# EAGLE schematic prototype1-with-charging-circut (EAGLE 9.2.2)

## Sheet 1 of 4
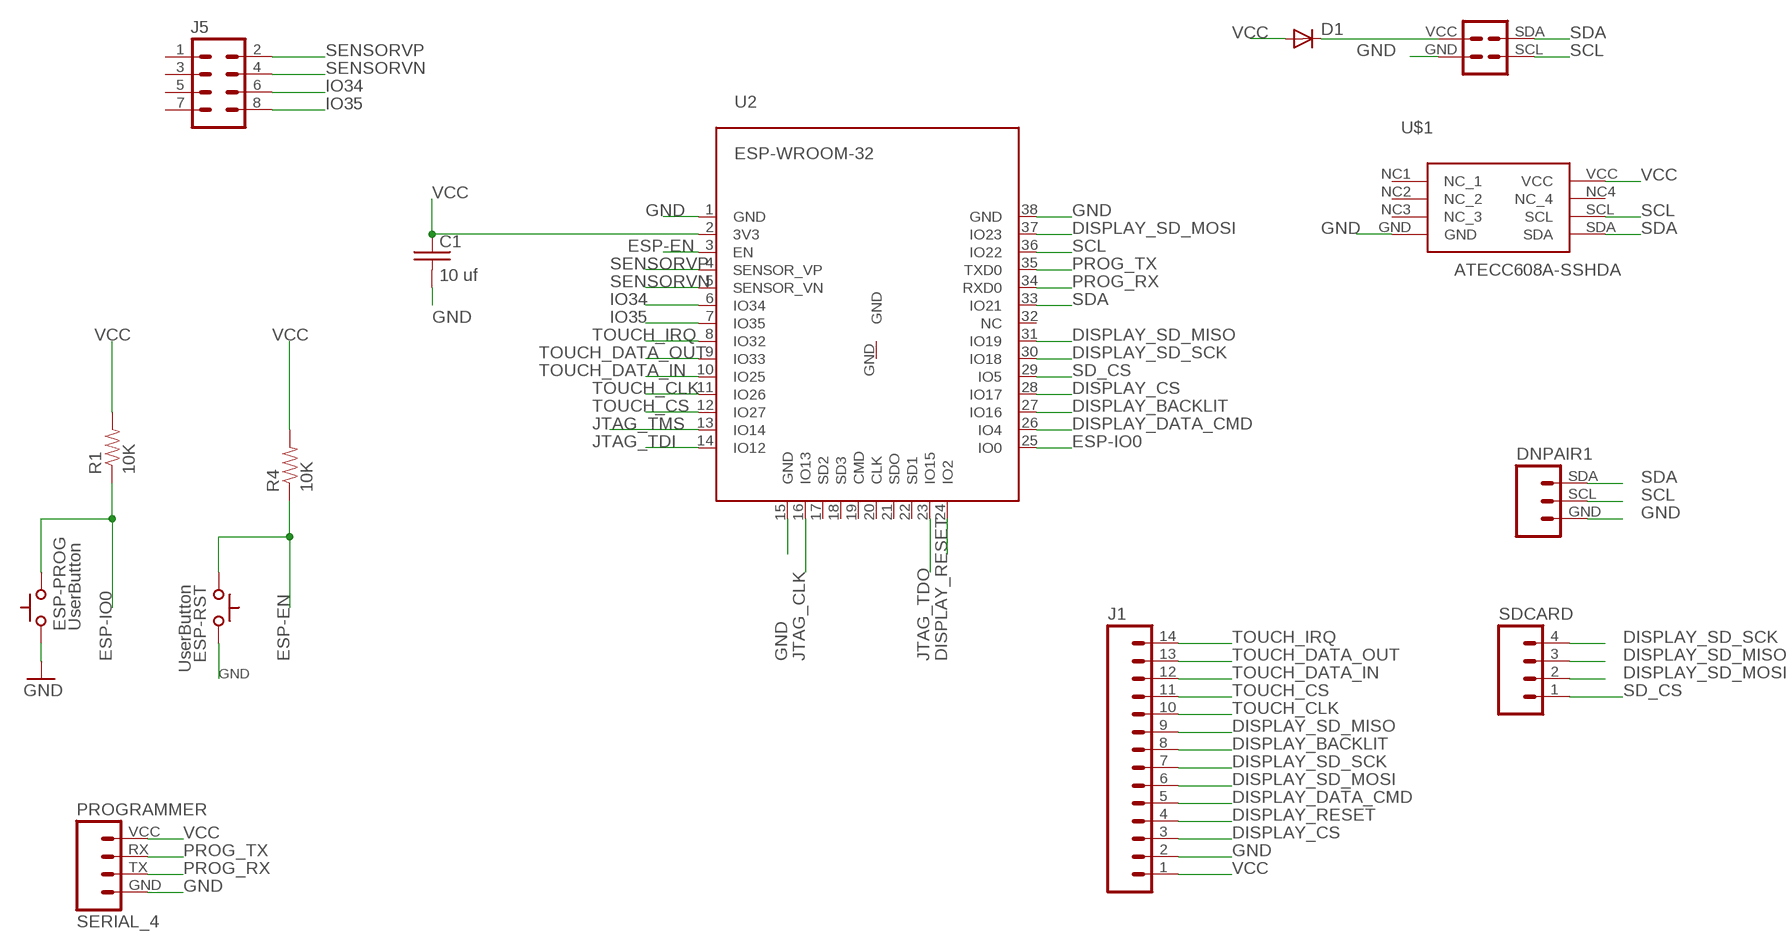
[diagram p0: schematic, sheet 1]

### Parts
C1  10 uf  C-USC0805  [C0805]
D1  DIODESMA  [SMA-DIODE]
DNPAIR1  DARKNET_8_PAIR_CONNECTORPTH  [1X03]
ESP-PROG  UserButton  SWITCH_TACTILETACTILE-2PIN-NARROW  [TACTILE-2PIN-NARROW]
ESP-RST  UserButton  SWITCH_TACTILETACTILE-2PIN-NARROW  [TACTILE-2PIN-NARROW]
J1  M14  [1X14]
J5  M04X2  [2X4]
PROGRAMMER  SERIAL_4  [SERIAL_HEADER_4]
R1  10K  RESISTOR0805-RES  [0805]
R4  10K  RESISTOR0805-RES  [0805]
SDCARD  M04PTH  [1X04]
SHITTY_ADDON  SAO1  DC26_SHITTY_ADDON_CONNECTORPTH  [DC26SHITTY_ADDON_CONNECTOR]
U2  ESP-WROOM-32  [ESP-WROOM-32]
U$1  ATECC608A-SSHDA  [8-SOIC]

### Nets
DISPLAY_BACKLIT: J1.8 U2.27(IO16)
DISPLAY_CS: J1.3 U2.28(IO17)
DISPLAY_DATA_CMD: J1.5 U2.26(IO4)
DISPLAY_RESET: J1.4 U2.24(IO2)
DISPLAY_SD_MISO: J1.9 SDCARD.3 U2.31(IO19)
DISPLAY_SD_MOSI: J1.6 SDCARD.2 U2.37(IO23)
DISPLAY_SD_SCK: J1.7 SDCARD.4 U2.30(IO18)
ESP-EN: ESP-RST.P$2(C) R4.1 U2.3(EN)
ESP-IO0: ESP-PROG.P$1(A) R1.1 U2.25(IO0)
GND: C1.2 DNPAIR1.GND ESP-PROG.P$2(C) ESP-RST.P$1(A) J1.2 PROGRAMMER.GND SHITTY_ADDON.GND U2.1(GND) U2.15(GND) U2.38(GND) U$1.GND ; also sheet 2,3,4
IO34: J5.6 U2.6(IO34)
IO35: J5.8 U2.7(IO35)
JTAG_CLK: U2.16(IO13) ; also sheet 2
JTAG_TDI: U2.14(IO12) ; also sheet 2
JTAG_TDO: U2.23(IO15) ; also sheet 2
JTAG_TMS: U2.13(IO14) ; also sheet 2
N$14: D1.C SHITTY_ADDON.VCC
PROG_RX: PROGRAMMER.TX U2.34(RXD0) ; also sheet 2
PROG_TX: PROGRAMMER.RX U2.35(TXD0) ; also sheet 2
SCL: DNPAIR1.SCL SHITTY_ADDON.SCL U2.36(IO22) U$1.SCL
SD_CS: SDCARD.1 U2.29(IO5)
SDA: DNPAIR1.SDA SHITTY_ADDON.SDA U2.33(IO21) U$1.SDA
SENSORVN: J5.4 U2.5(SENSOR_VN)
SENSORVP: J5.2 U2.4(SENSOR_VP)
TOUCH_CLK: J1.10 U2.11(IO26)
TOUCH_CS: J1.11 U2.12(IO27)
TOUCH_DATA_IN: J1.12 U2.10(IO25)
TOUCH_DATA_OUT: J1.13 U2.9(IO33)
TOUCH_IRQ: J1.14 U2.8(IO32)
VCC: C1.1 D1.A J1.1 PROGRAMMER.VCC R1.2 R4.2 U2.2(3V3) U$1.VCC ; also sheet 2,3,4
Unconnected: J5.1 J5.3 J5.5 J5.7 U2.17(SD2) U2.18(SD3) U2.19(CMD) U2.20(CLK) U2.21(SDO) U2.22(SD1) U2.32(NC) U2.GND U$1.NC1(NC_1) U$1.NC2(NC_2) U$1.NC3(NC_3) U$1.NC4(NC_4)

## Sheet 2 of 4
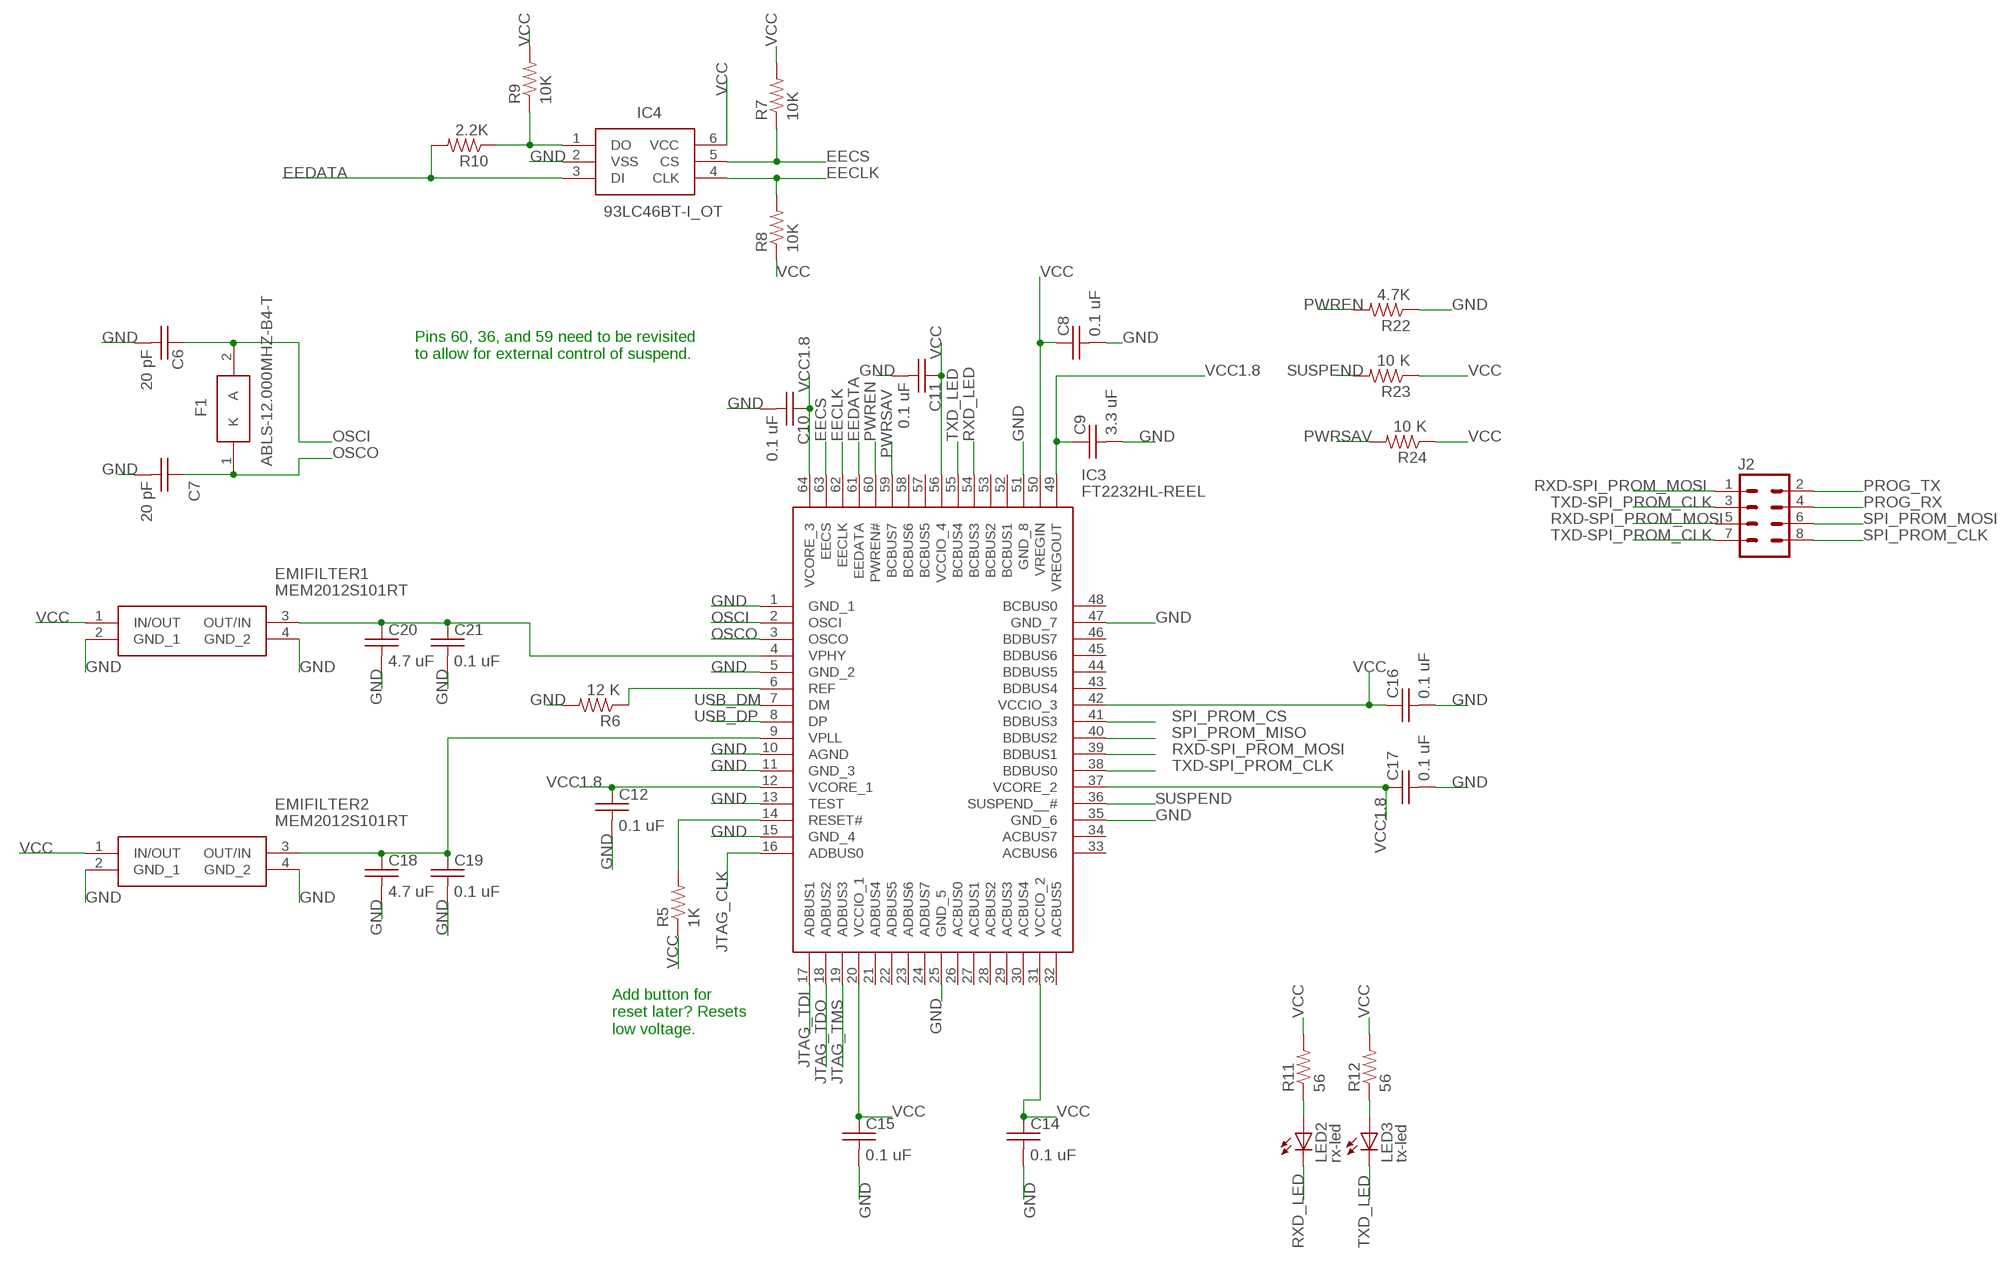
[diagram p1: schematic, sheet 2]

### Parts
C6  20 pF  C-USC0805  [C0805]
C7  20 pF  C-USC0805  [C0805]
C8  0.1 uF  C-USC0805  [C0805]
C9  3.3 uF  C-USC0805  [C0805]
C10  0.1 uF  C-USC0805  [C0805]
C11  0.1 uF  C-USC0805  [C0805]
C12  0.1 uF  C-USC0805  [C0805]
C14  0.1 uF  C-USC0805  [C0805]
C15  0.1 uF  C-USC0805  [C0805]
C16  0.1 uF  C-USC0805  [C0805]
C17  0.1 uF  C-USC0805  [C0805]
C18  4.7 uF  C-USC0805  [C0805]
C19  0.1 uF  C-USC0805  [C0805]
C20  4.7 uF  C-USC0805  [C0805]
C21  0.1 uF  C-USC0805  [C0805]
EMIFILTER1  MEM2012S101RT  [MEM2012S101RT]
EMIFILTER2  MEM2012S101RT  [MEM2012S101RT]
F1  ABLS-12.000MHZ-B4-T  [HC/49US-(AT49)_1]
IC3  FT2232HL-REEL  [QFP50P1200X1200X160-64N]
IC4  93LC46BT-I_OT  [SOT95P270X145-6N]
J2  M04X2  [2X4]
LED2  rx-led  LED3MM  [LED3MM]
LED3  tx-led  LED3MM  [LED3MM]
R5  1K  RESISTOR0805-RES  [0805]
R6  12 K  RESISTOR0805-RES  [0805]
R7  10K  RESISTOR0805-RES  [0805]
R8  10K  RESISTOR0805-RES  [0805]
R9  10K  RESISTOR0805-RES  [0805]
R10  2.2K  RESISTOR0805-RES  [0805]
R11  56  RESISTOR0805-RES  [0805]
R12  56  RESISTOR0805-RES  [0805]
R22  4.7K  RESISTOR0805-RES  [0805]
R23  10 K  RESISTOR0805-RES  [0805]
R24  10 K  RESISTOR0805-RES  [0805]

### Nets
EECLK: IC3.62(EECLK) IC4.4(CLK) R8.2
EECS: IC3.63(EECS) IC4.5(CS) R7.1
EEDATA: IC3.61(EEDATA) IC4.3(DI) R10.2
GND: C6.2 C7.2 C8.2 C9.2 C10.2 C11.2 C12.2 C14.2 C15.2 C16.2 C17.2 C18.2 C19.2 C20.2 C21.2 EMIFILTER1.2(GND_1) EMIFILTER1.4(GND_2) EMIFILTER2.2(GND_1) EMIFILTER2.4(GND_2) IC3.1(GND_1) IC3.5(GND_2) IC3.10(AGND) IC3.11(GND_3) IC3.13(TEST) IC3.15(GND_4) IC3.25(GND_5) IC3.35(GND_6) IC3.47(GND_7) IC3.51(GND_8) IC4.2(VSS) R6.2 R22.1 ; also sheet 1,3,4
JTAG_CLK: IC3.16(ADBUS0) ; also sheet 1
JTAG_TDI: IC3.17(ADBUS1) ; also sheet 1
JTAG_TDO: IC3.18(ADBUS2) ; also sheet 1
JTAG_TMS: IC3.19(ADBUS3) ; also sheet 1
N$6: IC3.14(RESET#) R5.2
N$7: IC3.6(REF) R6.1
N$8: IC4.1(DO) R9.1 R10.1
N$11: LED2.A R11.1
N$13: LED3.A R12.1
N$18: C18.1 C19.1 EMIFILTER2.3(OUT/IN) IC3.9(VPLL)
N$19: C20.1 C21.1 EMIFILTER1.3(OUT/IN) IC3.4(VPHY)
OSCI: C6.1 F1.2(A) IC3.2(OSCI)
OSCO: C7.1 F1.1(K) IC3.3(OSCO)
PROG_RX: J2.4 ; also sheet 1
PROG_TX: J2.2 ; also sheet 1
PWREN: IC3.60(PWREN#) R22.2
PWRSAV: IC3.59(BCBUS7) R24.2
RXD-SPI_PROM_MOSI: IC3.39(BDBUS1) J2.1 J2.5
RXD_LED: IC3.54(BCBUS3) LED2.K(C)
SPI_PROM_CLK: J2.8 ; also sheet 3
SPI_PROM_CS: IC3.41(BDBUS3) ; also sheet 3
SPI_PROM_MISO: IC3.40(BDBUS2) ; also sheet 3
SPI_PROM_MOSI: J2.6 ; also sheet 3
SUSPEND: IC3.36(SUSPEND__#) R23.2
TXD-SPI_PROM_CLK: IC3.38(BDBUS0) J2.3 J2.7
TXD_LED: IC3.55(BCBUS4) LED3.K(C)
USB_DM: IC3.7(DM) ; also sheet 4
USB_DP: IC3.8(DP) ; also sheet 4
VCC: C8.1 C11.1 C14.1 C15.1 C16.1 EMIFILTER1.1(IN/OUT) EMIFILTER2.1(IN/OUT) IC3.20(VCCIO_1) IC3.31(VCCIO_2) IC3.42(VCCIO_3) IC3.50(VREGIN) IC3.56(VCCIO_4) IC4.6(VCC) R5.1 R7.2 R8.1 R9.2 R11.2 R12.2 R23.1 R24.1 ; also sheet 1,3,4
VCC1.8: C9.1 C10.1 C12.1 C17.1 IC3.12(VCORE_1) IC3.37(VCORE_2) IC3.49(VREGOUT) IC3.64(VCORE_3)
Unconnected: IC3.21(ADBUS4) IC3.22(ADBUS5) IC3.23(ADBUS6) IC3.24(ADBUS7) IC3.26(ACBUS0) IC3.27(ACBUS1) IC3.28(ACBUS2) IC3.29(ACBUS3) IC3.30(ACBUS4) IC3.32(ACBUS5) IC3.33(ACBUS6) IC3.34(ACBUS7) IC3.43(BDBUS4) IC3.44(BDBUS5) IC3.45(BDBUS6) IC3.46(BDBUS7) IC3.48(BCBUS0) IC3.52(BCBUS1) IC3.53(BCBUS2) IC3.57(BCBUS5) IC3.58(BCBUS6)

### Notes on the sheet
- Pins 60, 36, and 59 need to be revisited 
  to allow for external control of suspend.
- Add button for 
  reset later? Resets
  low voltage.

## Sheet 3 of 4
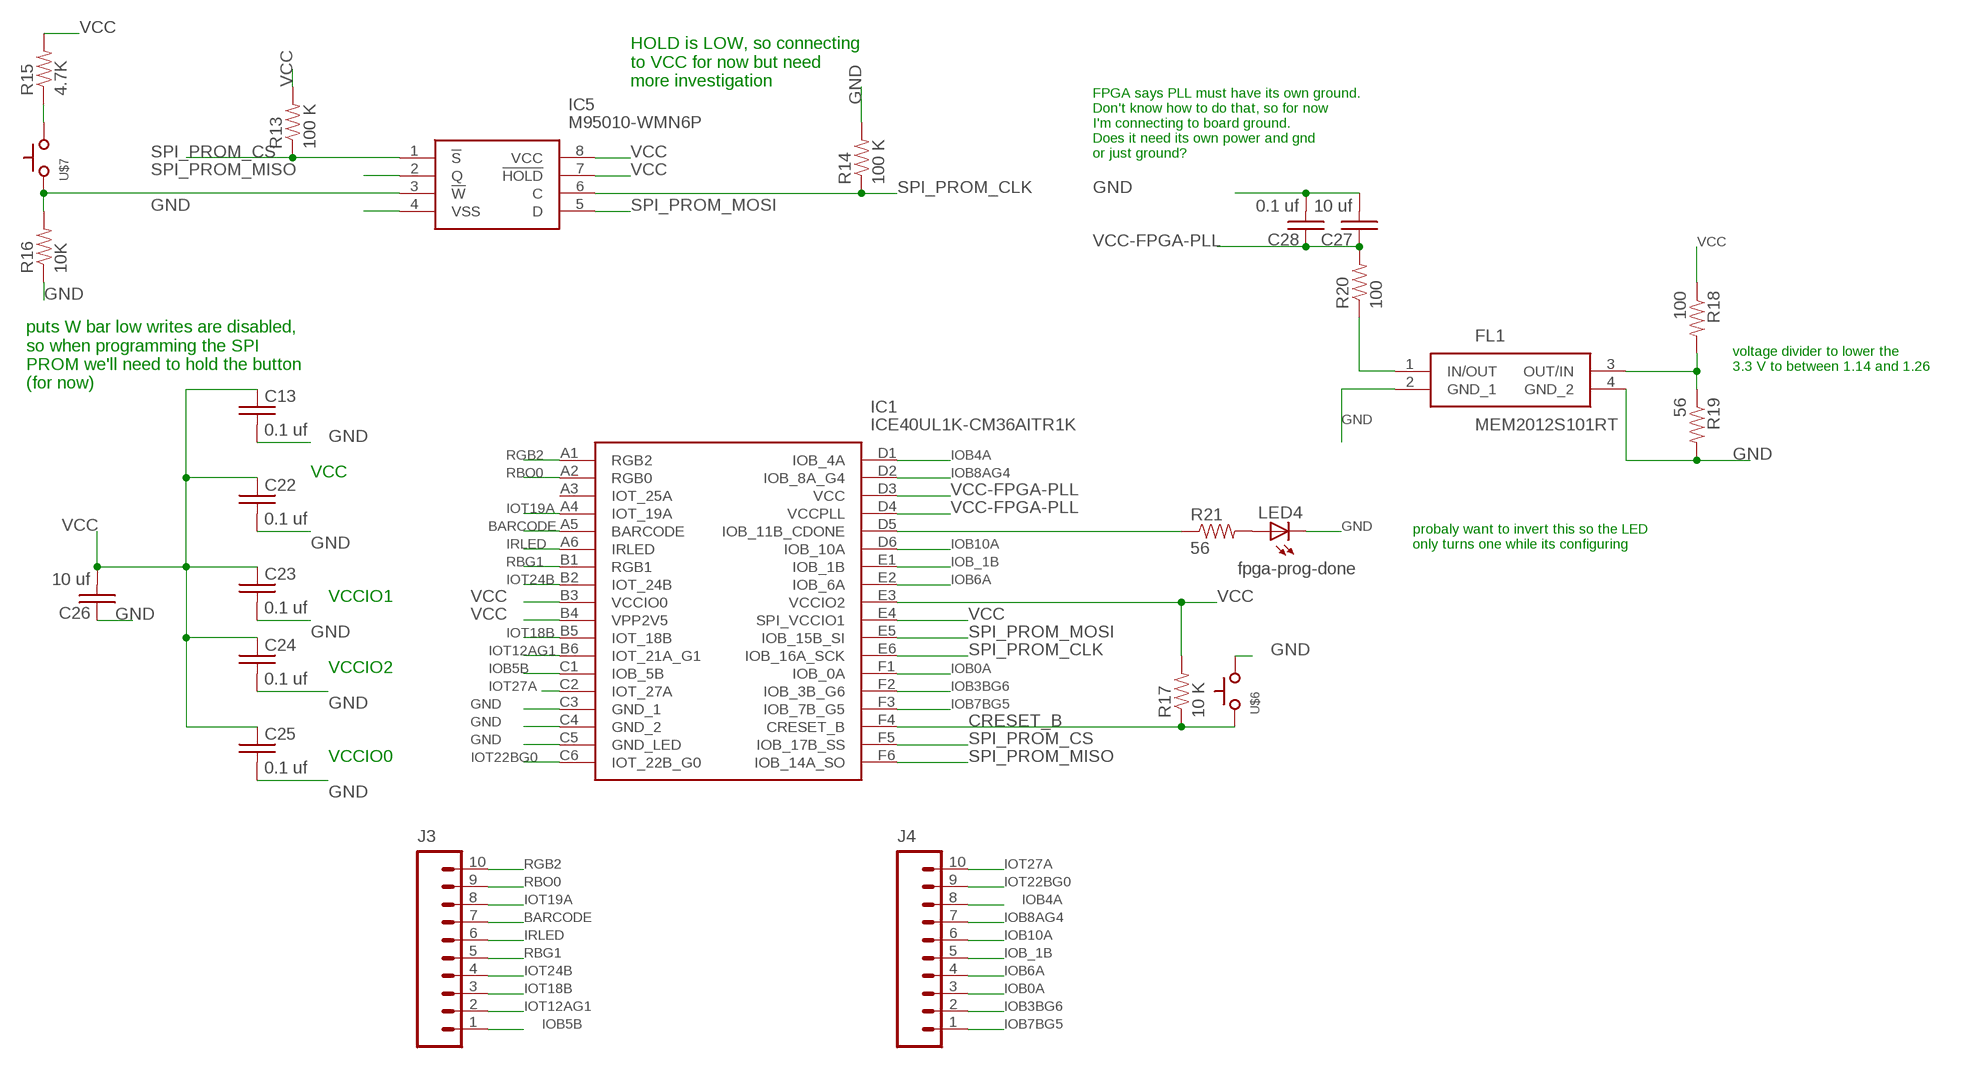
[diagram p2: schematic, sheet 3]

### Parts
C13  0.1 uf  C-USC0805  [C0805]
C22  0.1 uf  C-USC0805  [C0805]
C23  0.1 uf  C-USC0805  [C0805]
C24  0.1 uf  C-USC0805  [C0805]
C25  0.1 uf  C-USC0805  [C0805]
C26  10 uf  C-USC0805  [C0805]
C27  10 uf  C-USC0805  [C0805]
C28  0.1 uf  C-USC0805  [C0805]
FL1  MEM2012S101RT  [MEM2012S101RT]
IC1  ICE40UL1K-CM36AITR1K  [BGA36C40P6X6_250X250X91]
IC5  M95010-WMN6P  [SOIC127P600X175-8N]
J3  M10SILK_FEMALE_PTH  [1X10]
J4  M10SILK_FEMALE_PTH  [1X10]
LED4  fpga-prog-done  LED3MM  [LED3MM]
R13  100 K  RESISTOR0805-RES  [0805]
R14  100 K  RESISTOR0805-RES  [0805]
R15  4.7K  RESISTOR0805-RES  [0805]
R16  10K  RESISTOR0805-RES  [0805]
R17  10 K  RESISTOR0805-RES  [0805]
R18  100  RESISTOR0805-RES  [0805]
R19  56  RESISTOR0805-RES  [0805]
R20  100  RESISTOR0805-RES  [0805]
R21  56  RESISTOR0805-RES  [0805]
U$6  SWITCH_TACTILETACTILE-2PIN  [TACTILE-2PIN]
U$7  SWITCH_TACTILETACTILE-2PIN  [TACTILE-2PIN]

### Nets
BARCODE: IC1.A5(BARCODE) J3.7
CRESET_B: IC1.F4(CRESET_B) R17.1 U$6.P$2(C)
GND: C13.2 C22.2 C23.2 C24.2 C25.2 C26.1 C27.2 C28.2 FL1.2(GND_1) FL1.4(GND_2) IC1.C3(GND_1) IC1.C4(GND_2) IC1.C5(GND_LED) IC5.4(VSS) LED4.K(C) R14.2 R16.1 R19.2 U$6.P$1(A) ; also sheet 1,2,4
IOB0A: IC1.F1(IOB_0A) J4.3
IOB3BG6: IC1.F2(IOB_3B_G6) J4.2
IOB4A: IC1.D1(IOB_4A) J4.8
IOB5B: IC1.C1(IOB_5B) J3.1
IOB6A: IC1.E2(IOB_6A) J4.4
IOB7BG5: IC1.F3(IOB_7B_G5) J4.1
IOB8AG4: IC1.D2(IOB_8A_G4) J4.7
IOB10A: IC1.D6(IOB_10A) J4.6
IOB_1B: IC1.E1(IOB_1B) J4.5
IOT12AG1: IC1.B6(IOT_21A_G1) J3.2
IOT18B: IC1.B5(IOT_18B) J3.3
IOT19A: IC1.A4(IOT_19A) J3.8
IOT22BG0: IC1.C6(IOT_22B_G0) J4.9
IOT24B: IC1.B2(IOT_24B) J3.4
IOT27A: IC1.C2(IOT_27A) J4.10
IRLED: IC1.A6(IRLED) J3.6
N$3: IC5.3(!W) R16.2 U$7.P$2(C)
N$9: R15.1 U$7.P$1(A)
N$10: LED4.A R21.2
N$15: FL1.3(OUT/IN) R18.2 R19.1
N$16: FL1.1(IN/OUT) R20.1
N$17: IC1.D5(IOB_11B_CDONE) R21.1
RBG1: IC1.B1(RGB1) J3.5
RBO0: IC1.A2(RGB0) J3.9
RGB2: IC1.A1(RGB2) J3.10
SPI_PROM_CLK: IC1.E6(IOB_16A_SCK) IC5.6(C) R14.1 ; also sheet 2
SPI_PROM_CS: IC1.F5(IOB_17B_SS) IC5.1(!S) R13.1 ; also sheet 2
SPI_PROM_MISO: IC1.F6(IOB_14A_SO) IC5.2(Q) ; also sheet 2
SPI_PROM_MOSI: IC1.E5(IOB_15B_SI) IC5.5(D) ; also sheet 2
VCC: C13.1 C22.1 C23.1 C24.1 C25.1 C26.2 IC1.B3(VCCIO0) IC1.B4(VPP2V5) IC1.E3(VCCIO2) IC1.E4(SPI_VCCIO1) IC5.7(!HOLD) IC5.8(VCC) R13.2 R15.2 R17.2 R18.1 ; also sheet 1,2,4
VCC-FPGA-PLL: C27.1 C28.1 IC1.D3(VCC) IC1.D4(VCCPLL) R20.2
Unconnected: IC1.A3(IOT_25A)

### Notes on the sheet
- HOLD is LOW, so connecting 
  to VCC for now but need 
  more investigation
- FPGA says PLL must have its own ground.
  Don't know how to do that, so for now 
  I'm connecting to board ground.  
  Does it need its own power and gnd 
  or just ground?
- voltage divider to lower the 
  3.3 V to between 1.14 and 1.26
- puts W bar low writes are disabled, 
  so when programming the SPI 
  PROM we'll need to hold the button 
  (for now)
- VCC
- probaly want to invert this so the LED 
  only turns one while its configuring
- VCCIO1
- VCCIO2
- VCCIO0

## Sheet 4 of 4
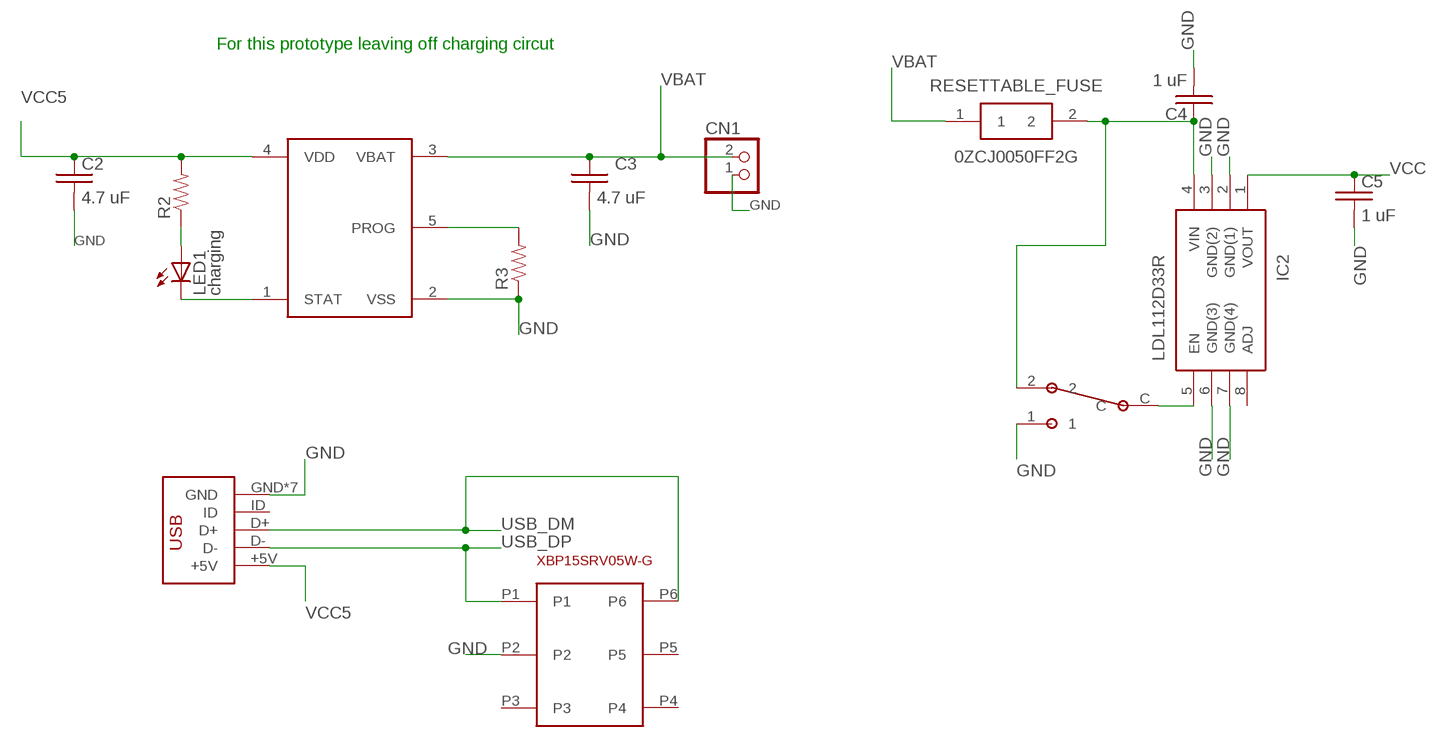
[diagram p3: schematic, sheet 4]

### Parts
C2  4.7 uF  C-USC0805  [C0805]
C3  4.7 uF  C-USC0805  [C0805]
C4  1 uF  C-USC0805  [C0805]
C5  1 uF  C-USC0805  [C0805]
CN1  JST_2PIN-THM-RA  [JST-PH-2-THM-RA]
IC2  LDL112D33R  [SOIC127P600X175-8N]
LED1  charging  LED0603  [LED-0603]
R2  RESISTOR0805-RES  [0805]
R3  RESISTOR0805-RES  [0805]
RESETTABLE_FUSE  0ZCJ0050FF2G  [FUSC3216X55N]
U$2  DX4R005JJ2DX4R005JJ2  [DX4R005JJ2]
U$3  XBP15SRV05W-G  [SOT-26P-XBP15SRV05W-G]
U$4  DS21984E  [SOT23-5]
U$5  SWITCH_SPDT  [SPDT_SSAJ120100]

### Nets
GND: C2.2 C3.2 C4.2 C5.2 CN1.1 IC2.2(GND(1)) IC2.3(GND(2)) IC2.6(GND(3)) IC2.7(GND(4)) R3.1 U$2.GND U$2.P$6(GND) U$2.P$7(GND) U$2.P$8(GND) U$2.P$9(GND) U$2.P$10(GND) U$2.P$11(GND) U$3.P2 U$4.2(VSS) U$5.1 ; also sheet 1,2,3
N$1: LED1.A R2.1
N$2: LED1.C U$4.1(STAT)
N$4: R3.2 U$4.5(PROG)
N$5: C4.1 IC2.4(VIN) RESETTABLE_FUSE.2 U$5.2
N$12: IC2.5(EN) U$5.C
USB_DM: U$2.D+ U$3.P6 ; also sheet 2
USB_DP: U$2.D- U$3.P1 ; also sheet 2
VBAT: C3.1 CN1.2 RESETTABLE_FUSE.1 U$4.3(VBAT)
VCC: C5.1 IC2.1(VOUT) ; also sheet 1,2,3
VCC5: C2.1 R2.2 U$2.+5V U$4.4(VDD)
Unconnected: IC2.8(ADJ) U$2.ID U$3.P3 U$3.P4 U$3.P5

### Notes on the sheet
- For this prototype leaving off charging circut

## Library data of the parts
C1-C28 = passives:C-US: CAPACITOR, American symbol
CN1 = connector:JST_2PIN: JST 2-Pin Connectors of various flavors SMT-RA (S2B-PH-SM4) 4UConnector #17311 SMT (B2B-PH-SM4) THM-RA (S2B-PH) THM (B2B-PH)
D1 = passives:DIODE: Diode These are standard reverse protection diodes and small signal diodes. SMA package can handle up to about 1A. SOD-323 can handle about 200mA. What the SOD-323 package when ordering, there are some mfgs out there that are 5-pin packages.
DNPAIR1 = darknet8:DARKNET_8_PAIR_CONNECTOR: Header 3 Standard 3-pin 0.1" header. Use with straight break away headers (SKU : PRT-00116), right angle break away headers (PRT-00553), swiss pins (PRT-00743), machine pins (PRT-00117), and female headers (PRT-00115).
EMIFILTER1 EMIFILTER2 FL1 = passives:MEM2012S101RT: EMI Filter Circuits Source: Datasheet <https://componentsearchengine.com/Datasheets/1/MEM2012S101RT.pdf>; DESCRIPTION: EMI Filter Circuits; HEIGHT: 1mm; MANUFACTURER_NAME: TDK; MANUFACTURER_PART_NUMBER: MEM2012S101RT; MOUSER_PART_NUMBER: N/A
ESP-PROG ESP-RST = dc-26:SWITCH_TACTILE
F1 = crystals-timing:ABLS-12.000MHZ-B4-T: ABRACON - ABLS-12.000MHZ-B4-T - CRYSTAL, 12MHZ, 18PF, HC-49US Source: Datasheet <https://componentsearchengine.com/Datasheets/2/ABLS-12.000MHZ-B4-T.pdf>; DESCRIPTION: ABRACON - ABLS-12.000MHZ-B4-T - CRYSTAL, 12MHZ, 18PF, HC-49US; HEIGHT: mm; MANUFACTURER_NAME: ABRACON; MANUFACTURER_PART_NUMBER: ABLS-12.000MHZ-B4-T; MOUSER_PART_NUMBER: 815-ABLS-12.0M-T; MOUSER_PRICE-STOCK: https://www.mouser.com/Search/Refine.aspx?Keyword=815-ABLS-12.0M-T; RS_PART_NUMBER: 1710207; RS_PRICE-STOCK: http://uk.rs-online.com/web/p/products/1710207
IC1 = FPGA:ICE40UL1K-CM36AITR1K: FPGA - Field Programmable Gate Array FPGA iCE40-UltraLite 1.2V CBGA PKG Source: Datasheet <http://www.latticesemi.com/~/media/LatticeSemi/Documents/DataSheets/iCE/iCE40UltraLiteDataSheetDS1050.pdf?document_id=50945>; DESCRIPTION: FPGA - Field Programmable Gate Array FPGA iCE40-UltraLite 1.2V CBGA PKG; HEIGHT: 0.91mm; MANUFACTURER_NAME: Lattice; MANUFACTURER_PART_NUMBER: ICE40UL1K-CM36AITR1K; MOUSER_PART_NUMBER: 842-40UL1KCM36AITR1K; MOUSER_PRICE-STOCK: https://www.mouser.com/Search/Refine.aspx?Keyword=842-40UL1KCM36AITR1K
IC2 = voltage-regulator:LDL112D33R: LDO Voltage Regulators 1.2 A low quiescent current LDO with reverse current protection Source: Datasheet <https://www.arrow.com/en/products/ldl112d33r/stmicroelectronics>; ARROW_PART_NUMBER: LDL112D33R; ARROW_PRICE/STOCK: https://www.arrow.com/en/products/ldl112d33r/stmicroelectronics; DESCRIPTION: LDO Voltage Regulators 1.2 A low quiescent current LDO with reverse current protection; HEIGHT: 1.75mm; MANUFACTURER_NAME: STMicroelectronics; MANUFACTURER_PART_NUMBER: LDL112D33R
IC3 = ICs:FT2232HL-REEL: FTDI Chip FT2232HL-REEL, USB Controller, 4-channel, 480MBps, USB 2.0, 64-Pin LQFP Source: Datasheet <https://componentsearchengine.com/Datasheets/1/FT2232HL-REEL.pdf>; DESCRIPTION: FTDI Chip FT2232HL-REEL, USB Controller, 4-channel, 480MBps, USB 2.0, 64-Pin LQFP; HEIGHT: 1.6mm; MANUFACTURER_NAME: FTDI Chip; MANUFACTURER_PART_NUMBER: FT2232HL-REEL; MOUSER_PART_NUMBER: 895-FT2232HL
IC4 = eeprom:93LC46BT-I_OT: 1K,64 X 16 Serial EE,SOT23 Source: Datasheet <https://componentsearchengine.com/Datasheets/1/93LC46BT-I_OT.pdf>; DESCRIPTION: 1K,64 X 16 Serial EE,SOT23; HEIGHT: 1.45mm; MANUFACTURER_NAME: Microchip; MANUFACTURER_PART_NUMBER: 93LC46BT-I/OT; MOUSER_PART_NUMBER: 579-93LC46BT-I/OT
IC5 = eeprom:M95010-WMN6P: M95010-WMN6P, Serial EEPROM Memory 1kbit, Serial-SPI, 35ns 2.5 5.5 V, 8-Pin SOIC Source: Datasheet <http://www.st.com/st-web-ui/static/active/en/resource/technical/document/datasheet/CD00001755.pdf>; ALLIED_NUMBER: 70389563; ALLIED_PRICE-STOCK: http://www.alliedelec.com/stmicroelectronics-m95010-wmn6p/70389563/; DESCRIPTION: M95010-WMN6P, Serial EEPROM Memory 1kbit, Serial-SPI, 35ns 2.5 5.5 V, 8-Pin SOIC; HEIGHT: 1.75mm; MANUFACTURER_NAME: STMicroelectronics; MANUFACTURER_PART_NUMBER: M95010-WMN6P; MOUSER_PART_NUMBER: 511-M95010-WMN6P; MOUSER_PRICE-STOCK: https://www.mouser.com/Search/Refine.aspx?Keyword=511-M95010-WMN6P; RS_PART_NUMBER: 7147617; RS_PRICE-STOCK: http://uk.rs-online.com/web/p/eeprom-memory-chips/7147617/?source=DS
J1 = connector:M14: Header 14 Standard 14-pin 0.1" header. Use with straight break away headers (SKU : PRT-00116), right angle break away headers (PRT-00553), swiss pins (PRT-00743), machine pins (PRT-00117), and female headers (PRT-00115).
J2 J5 = connector:M04X2: .1" header, two rows of four.
J3 J4 = connector:M10: Header 10 Standard 10-pin 0.1" header. Use with straight break away headers (SKU : PRT-00116), right angle break away headers (PRT-00553), swiss pins (PRT-00743), machine pins (PRT-00117), and female headers (PRT-00115).; PROD_ID: CONN-11563
LED1-LED4 = leds:LED: LEDs Standard schematic elements and footprints for 5mm, 3mm, 1206, and 0603 sized LEDs. 5mm - Spark Fun Electronics SKU : COM-00529 (and others)
PROGRAMMER = connector:SERIAL_4
R1 R4 = dc-26:RESISTOR: Resistor Basic schematic elements and footprints for 0603, 1206, and PTH resistors.
R2 R3 R5-R24 = passives:RESISTOR: Resistor Basic schematic elements and footprints for 0603, 1206, and PTH resistors.
RESETTABLE_FUSE = passives:0ZCJ0050FF2G: Resettable Fuses - PPTC <https://componentsearchengine.com/Images/9/0ZCJ0050FF2G.jpg> Source: Datasheet <https://www.belfuse.com/resources/CircuitProtection/datasheets/0ZCJ Nov2016.pdf>; DESCRIPTION: Resettable Fuses - PPTC; HEIGHT: 0.55mm; MANUFACTURER_NAME: Bel-Stewart; MANUFACTURER_PART_NUMBER: 0ZCJ0050FF2G; SUPPLIER_NAME: RS
SDCARD = connector:M04: Header 4 Standard 4-pin 0.1" header. Use with straight break away headers (SKU : PRT-00116), right angle break away headers (PRT-00553), swiss pins (PRT-00743), machine pins (PRT-00117), and female headers (PRT-00115). Molex polarized connector foot print use with SKU : PRT-08231 with associated crimp pins and housings. 1MM SMD Version SKU: PRT-10208; PROD_ID: CONN-09696
SHITTY_ADDON = defcon:DC26_SHITTY_ADDON_CONNECTOR: Standard 2-pin 0.1" header. Use with - straight break away headers ( PRT-00116) - right angle break away headers (PRT-00553) - swiss pins (PRT-00743) - machine pins (PRT-00117) - female headers (PRT-00115) Molex polarized connector foot print use with: PRT-08233 with associated crimp pins and housings. 2.54_SCREWTERM for use with PRT-10571. 3.5mm Screw Terminal footprints for PRT-08084 5mm Screw Terminal footprints for use with PRT-08432
U2 = ICs:ESP-WROOM-32
U$1 = ICs:ATECC608A-SSHDA
U$2 = connector:DX4R005JJ2
U$3 = passives:XBP15SRV05W-G: Low Capacitance TVS Diode Array (used for USB) P1->D- (usb1) P2->GND P3->D- (usb2) P4->D+ (usb2) P5->NC P6->D+(usb1) Datasheet <https://www.torexsemi.com/file/xbp15srv05w/XBP15SRV05W.pdf>; DIGI_KEY_PART_NUMBER: 893-1422-1-ND; MANUFACTURER_PART_NUMBER: XBP15SRV05W-G
U$4 = charging-ic:DS21984E
U$5 = switches:SWITCH_SPDT
U$6 U$7 = switches:SWITCH_TACTILE